# Altium schematic sheet Pre-regulation.SchDoc
size A
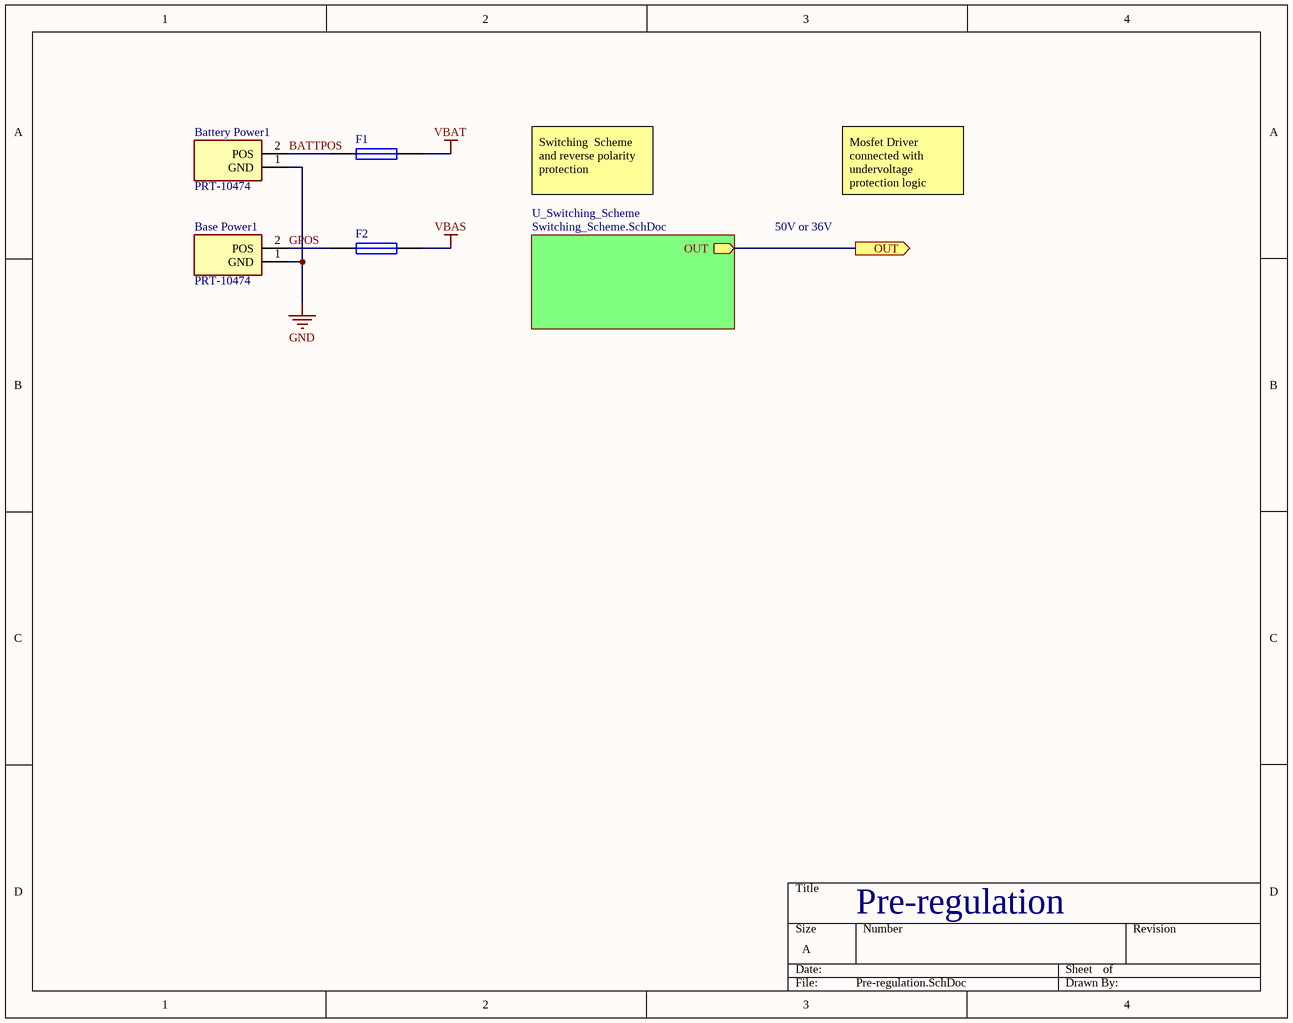
[diagram p0: Pre-regulation.SchDoc]

## Parts
Base_Power1  PRT-10474  [PRT-10474]
Battery_Power1  PRT-10474  [PRT-10474]
F1  Battery Power Fuse  [14-1210]  (value not drawn)
F2  Ground Power Fuse  [14-1210]  (value not drawn)

## Sub-sheets
U_Switching_Scheme = Switching_Scheme.SchDoc: OUT (out)

## Ports
OUT (out)

## Nets
GND: Base_Power1.1(GND) Battery_Power1.1(GND)
VBAS: F2.2
VBAT: F1.2
BATTPOS: Battery_Power1.2(POS) F1.1
GPOS: Base_Power1.2(POS) F2.1
OUT: port OUT, sheet U_Switching_Scheme/OUT

## Notes on the sheet
- Switching  Scheme and reverse polarity protection
- 50V or 36V
- Mosfet Driver connected with undervoltage protection logic
- Pre-regulation

## Library data of the parts
Base_Power1 Battery_Power1 = PRT-10474: Connector; Manufacturer_Name: SparkFun; Datasheet Link: http://cdn.sparkfun.com/datasheets/Prototyping/xt60.pdf; Height: 15.875mm; Manufacturer_Part_Number: PRT-10474; Mouser Part Number: 474-PRT-10474; Mouser Price/Stock: https://www.mouser.com/Search/Refine.aspx?Keyword=474-PRT-10474
F1 F2 = Fuse 1: Fuse; Published: 8-Jun-2000; LatestRevisionDate: 17-Jul-2002; LatestRevisionNote: Re-released for DXP Platform.; PackageReference: PIN-W2/E2.8; Publisher: Altium Limited; PackageDescription: Thru-Hole; 2 Leads